# Altium schematic sheet ublox_GPS.SchDoc
size A4; SheetNumber: 5; SheetTotal: 6
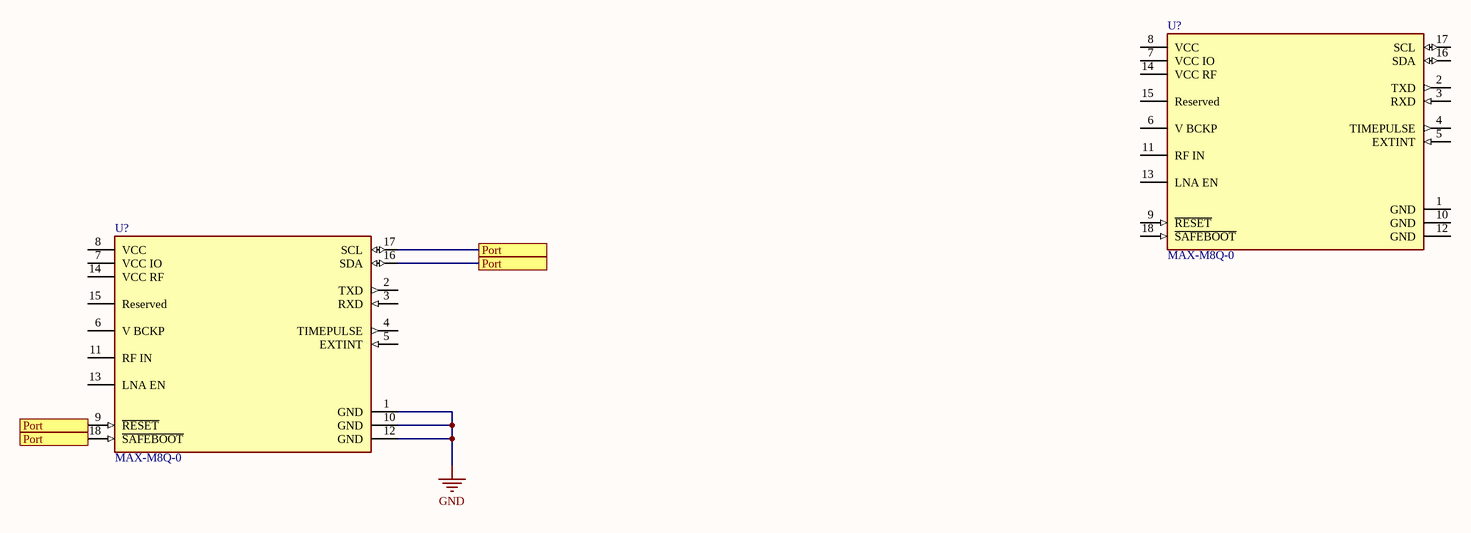
[diagram p0: ublox_GPS.SchDoc]

## Parts
(Parts that share a designator on the sheet are numbered #1, #2 ... from top to bottom, then left to right.)
U?#1  MAX-M8Q-0  [FP-MAX-M8Q-0-MFG]
U?#2  MAX-M8Q-0  [FP-MAX-M8Q-0-MFG]

## Ports
Port

## Nets
GND: U?#2.1(GND) U?#2.10(GND) U?#2.12(GND)
Port: U?#2.9(~{RESET}) U?#2.16(SDA) U?#2.17(SCL) U?#2.18(~{SAFEBOOT}) ; port Port

Not connected (* = marked no-connect by the designer): U?#1 1(GND) 2(TXD) 3(RXD) 4(TIMEPULSE) 5(EXTINT) 6(V_BCKP) 7(VCC_IO) 8(VCC) 9(~{RESET}) 10(GND) 11(RF_IN) 12(GND) 13(LNA_EN) 14(VCC_RF) 15(Reserved) 16(SDA) 17(SCL) 18(~{SAFEBOOT}); U?#2 2(TXD) 3(RXD) 4(TIMEPULSE) 5(EXTINT) 6(V_BCKP) 7(VCC_IO) 8(VCC) 11(RF_IN) 13(LNA_EN) 14(VCC_RF) 15(Reserved)

## Library data of the parts
U?#1 U?#2 = CMP-207130-000017-1: RF RCVR GNSS/GPS 1.575GHZ 18LCC; Sensitivity: -167dBm; Current - Receiving: 23mA; Interface: I2C; Frequency: 1.575GHz; Min Operating Temperature: -40°C; Case/Package: SMD/SMT; RoHS Compliant: Yes; Packaging: Cut Tape; Max Operating Temperature: 85°C